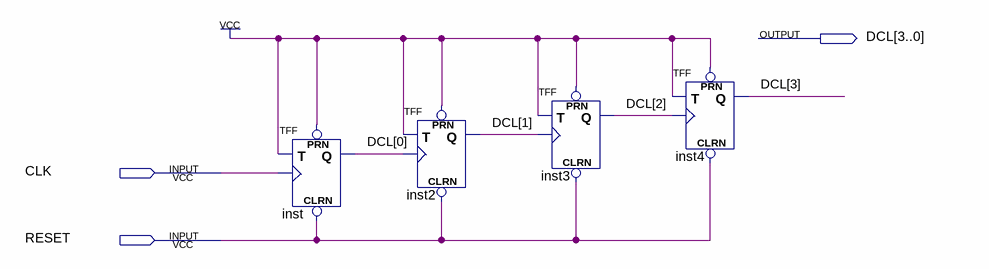
[diagram p0: schematic sheet]
// Quartus schematic dcel4.bdf as structural Verilog: 4 symbols, 3 pins
module dcel4 (
  input  CLK,
  input  RESET,
  output [3:0] DCL
);

  TFF inst (.PRN(1'b1), .CLRN(RESET), .T(1'b1), .CLK(CLK), .Q(DCL[0]));
  TFF inst2 (.PRN(1'b1), .CLRN(RESET), .T(1'b1), .CLK(DCL[0]), .Q(DCL[1]));
  TFF inst3 (.PRN(1'b1), .CLRN(RESET), .T(1'b1), .CLK(DCL[1]), .Q(DCL[2]));
  TFF inst4 (.PRN(1'b1), .CLRN(RESET), .T(1'b1), .CLK(DCL[2]), .Q(DCL[3]));
endmodule
